# Altium project PCB_PROJECT1.PRJPCB
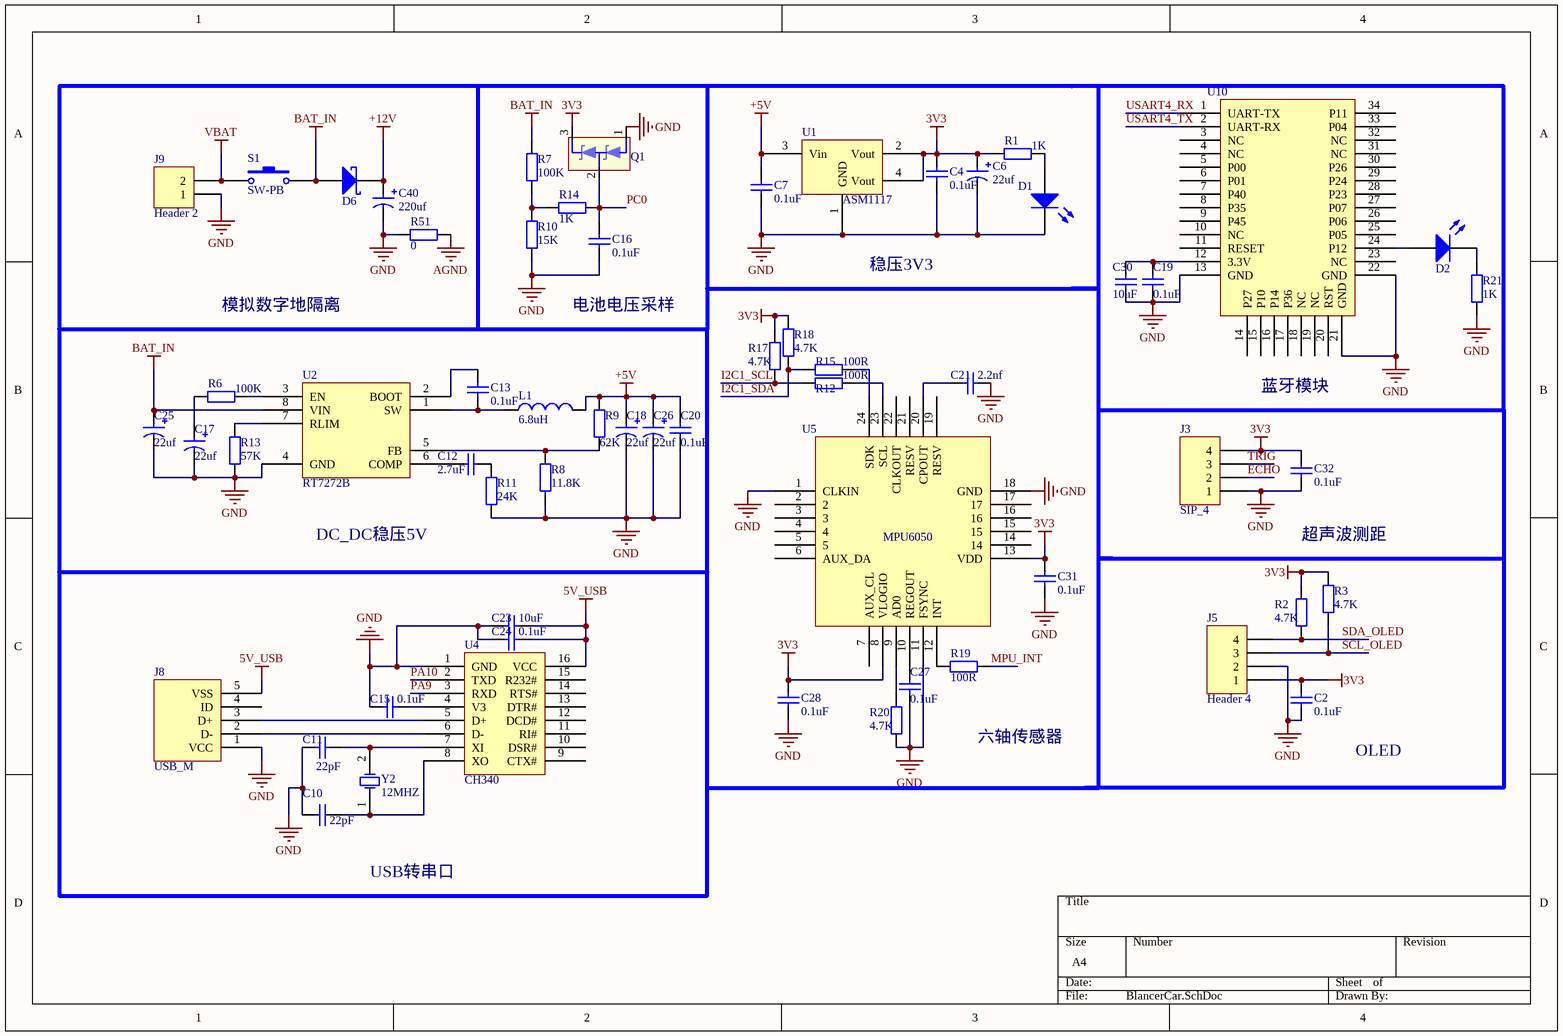
[diagram p0: BlancerCar.SchDoc]
3 sheets, 138 parts. Net scope: global (net labels, ports and power ports of the same name join across sheets).
Board file: BlanceCar.PcbDoc
Sheets:
  BlancerCar.SchDoc
  BlancerCarMicrocontrollers.SchDoc
  BlancerCarMotoDriver.SchDoc

## Sheet BlancerCar.SchDoc
size A4

### Parts
C2  value 0.1uF  [0805-1]  (hidden comment: Cap)
C4  value 0.1uF  [0805-1]  (hidden comment: Cap)
C6  value 22uf  [钽电容XDH]  (hidden comment: Cap钽电容)
C7  value 0.1uF  [0805-1]  (hidden comment: Cap)
C10  value 22pF  [0805-1]  (hidden comment: Cap)
C11  value 22pF  [0805-1]  (hidden comment: Cap)
C12  value 2.7uF  [0805-1]  (hidden comment: Cap)
C13  value 0.1uF  [0805-1]  (hidden comment: Cap)
C15  value 0.1uF  [0805-1]  (hidden comment: Cap)
C16  value 0.1uF  [0805-1]  (hidden comment: Cap)
C17  value 22uf  [钽电容XDH]  (hidden comment: Cap钽电容)
C18  value 22uf  [钽电容XDH]  (hidden comment: Cap钽电容)
C19  value 0.1uF  [0805-1]  (hidden comment: Cap)
C20  value 0.1uF  [0805-1]  (hidden comment: Cap)
C21  value 2.2nf  [0805-1]  (hidden comment: Cap)
C23  value 10uF  [0805-1]  (hidden comment: Cap)
C24  value 0.1uF  [0805-1]  (hidden comment: Cap)
C25  value 22uf  [钽电容XDH]  (hidden comment: Cap钽电容)
C26  value 22uf  [钽电容XDH]  (hidden comment: Cap钽电容)
C27  value 0.1uF  [0805-1]  (hidden comment: Cap)
C28  value 0.1uF  [0805-1]  (hidden comment: Cap)
C30  value 10uF  [0805-1]  (hidden comment: Cap)
C31  value 0.1uF  [0805-1]  (hidden comment: Cap)
C32  value 0.1uF  [0805-1]  (hidden comment: Cap)
C40  value 220uf  [电容220UF]  (hidden comment: Cap钽电容)
D1  LED0  [LED_0805]  (value not drawn)
D2  LED0  [LED_0805]  (value not drawn)
D6  肖基特二极管  [SS54]  (value not drawn)
J3  SIP_4  [HDR1X4]
J5  Header 4  [HDR1X4]
J8  USB_M  [USB_MICRO]
J9  Header 2  [T字公头]
L1  value 6.8uH  [33uh电感]  (hidden comment: Inductor)
Q1  肖基特二极管  [BAT54S(SOT-23-3)]  (value not drawn)
R1  value 1K  [0805-1]  (hidden comment: Res1)
R2  value 4.7K  [0805-1]  (hidden comment: Res1)
R3  value 4.7K  [0805-1]  (hidden comment: Res1)
R6  value 100K  [0805-1]  (hidden comment: Res1)
R7  value 100K  [0805-1]  (hidden comment: Res1)
R8  value 11.8K  [0805-1]  (hidden comment: Res1)
R9  value 62K  [0805-1]  (hidden comment: Res1)
R10  value 15K  [0805-1]  (hidden comment: Res1)
R11  value 24K  [0805-1]  (hidden comment: Res1)
R12  value 100R  [0805-1]  (hidden comment: Res1)
R13  value 57K  [0805-1]  (hidden comment: Res1)
R14  value 1K  [0805-1]  (hidden comment: Res1)
R15  value 100R  [0805-1]  (hidden comment: Res1)
R17  value 4.7K  [0805-1]  (hidden comment: Res1)
R18  value 4.7K  [0805-1]  (hidden comment: Res1)
R19  value 100R  [0805-1]  (hidden comment: Res1)
R20  value 4.7K  [0805-1]  (hidden comment: Res1)
R21  value 1K  [0805-1]  (hidden comment: Res1)
R51  value 0  [0805-1]  (hidden comment: Res1)
S1  SW-PB  [开关 6A]
U1  ASM1117  [ASM1117]
U2  RT7272B  [SOIC_8(LC)]
U4  CH340  [SOP16]
U5  MPU6050  [MPU6050]
U10  蓝牙模块  [LANYA]  (value not drawn)
Y2  12MHZ  [晶振 8M]

### Nets
3V3: C2.2 C4.2 C6.1 C28.2 C31.2 C32.2 J3.4 J5.1 Q1.3 R1.1 R2.2 R3.2 R17.2 R18.2 U1.2(Vout) U1.4(Vout) U5.8(VLOGIO) U5.13(VDD)
5V_USB: C23.2 C24.2 J8.5(VSS) U4.16(VCC)
+5V: C7.2 C18.1 C20.1 C26.1 L1.2 R9.2 U1.3(Vin)
+12V: C40.1 D6.2(K)
AGND: R51.2
BAT_IN: C25.1 D6.1(A) R7.2 S1.2 U2.8(VIN)
GND: C2.1 C4.1 C6.2 C7.1 C10.2 C11.2 C15.1 C16.1 C17.2 C18.2 C19.1 C20.2 C21.2 C23.1 C24.1 C25.2 C26.2 C27.1 C28.1 C30.1 C31.1 C32.1 C40.2 D1.2(K) J3.1 J5.2 J8.1(VCC) J9.1 Q1.1 R8.1 R10.1 R11.1 R13.1 R20.1 R21.1 R51.1 U1.1(GND) U2.4(GND) U4.1(GND) U5.1(CLKIN) U5.11(FSYNC) U5.18(GND) U10.13(GND) U10.21(GND) U10.22(GND)
VBAT: J9.2 S1.1
ECHO: J3.2
I2C1_SCL: R12.2 R17.1
I2C1_SDA: R15.2 R18.1
MPU_INT: R19.1
PA9: U4.3(RXD)
PA10: U4.2(TXD)
PC0: C16.2 Q1.2 R14.1
SCL_OLED: J5.3 R3.1
SDA_OLED: J5.4 R2.1
TRIG: J3.3
USART4_RX: U10.1(UART-TX)
USART4_TX: U10.2(UART-RX)
NetC10_1: C10.1 U4.8(XO) Y2.1(OSC1)
NetC11_1: C11.1 U4.7(XI) Y2.2(OSC2)
NetC12_1: C12.1 U2.6(COMP)
NetC12_2: C12.2 R11.2
NetC13_1: C13.1 L1.1 U2.1(SW)
NetC13_2: C13.2 U2.2(BOOT)
NetC15_2: C15.2 U4.4(V3)
NetC17_1: C17.1 R6.1
NetC19_2: C19.2 C30.2 U10.12(3.3V)
NetC21_1: C21.1 U5.20(CPOUT)
NetC27_2: C27.2 U5.10(REGOUT)
NetD1_1: D1.1(A) R1.2
NetD2_1: D2.1(A) U10.24(P12)
NetD2_2: D2.2(K) R21.2
NetJ8_2: J8.2(D-) U4.6(D-)
NetJ8_3: J8.3(D+) U4.5(D+)
NetR6_2: R6.2 U2.3(EN)
NetR7_1: R7.1 R10.2 R14.2
NetR8_2: R8.2 R9.1 U2.5(FB)
NetR12_1: R12.1 U5.23(SCL)
NetR13_2: R13.2 U2.7(RLIM)
NetR15_1: R15.1 U5.24(SDK)
NetR19_2: R19.2 U5.12(INT)
NetR20_2: R20.2 U5.9(AD0)

Not connected (* = marked no-connect by the designer): J8 4(ID); U4 9(CTX#) 10(DSR#) 11(RI#) 12(DCD#) 13(DTR#) 14(RTS#) 15(R232#); U5 2 3 4 5 6(AUX_DA) 7(AUX_CL) 14 15 16 17 19(RESV) 21(RESV) 22(CLKOUT); U10 3(NC) 4(NC) 5(P00) 6(P01) 7(P40) 8(P35) 9(P45) 10(NC) 11(RESET) 14(P27) 15(P10) 16(P14) 17(P36) 18(NC) 19(NC) 20(RST) 23(NC) 25(P05) 26(P06) 27(P07) 28(P23) 29(P24) 30(P26) 31(NC) 32(NC) 33(P04) 34(P11)

### Notes on the sheet
- 模拟数字地隔离
- 电池电压采样
- 稳压3V3
- 蓝牙模块
- DC_DC稳压5V
- 超声波测距
- 六轴传感器
- OLED
- USB转串口

### Library data of the parts
C2 C4 C7 C10-C13 C15 C16 C19-C21 C23 C24 C27 C28 C30-C32 = Cap: Capacitor; Published: 8-Jun-2000; LatestRevisionDate: 17-Jul-2002; LatestRevisionNote: Re-released for DXP Platform.; PackageReference: RAD-0.3; Publisher: Altium Limited
C6 C17 C18 C25 C26 C40 = Cap-dan
D1 D2 = LED0: 发光二极管; Published: 8-Jun-2000; LatestRevisionDate: 08-Jul-2005; LatestRevisionNote: Mech Layer 1 removed.; PackageReference: LED-0; Publisher: Altium Limited
D6 = SS54
J3 J5 = Header 4: Header, 4-Pin; LatestRevisionDate: 17-Jul-2002; LatestRevisionNote: Re-released for DXP Platform.; Publisher: Altium Limited
J8 = USB_M: MicroUSB接口
J9 = Header 2: Header, 2-Pin; LatestRevisionDate: 17-Jul-2002; LatestRevisionNote: Re-released for DXP Platform.; Publisher: Altium Limited
L1 = Inductor: Code_IEC: 1005; Published: 8-Jun-2000; LatestRevisionDate: 29-May-2009; LatestRevisionNote: IPC-7351 Footprint Added.; PackageReference: 0402-A; Publisher: Altium Limited; PackageDescription: Chip Inductor; Code_JEITA: 0402
Q1 = BAT54S
R1-R3 R6-R15 R17-R21 R51 = Res1: 贴片电阻; Published: 8-Jun-2000; LatestRevisionDate: 17-Jul-2002; LatestRevisionNote: Re-released for DXP Platform.; PackageReference: AXIAL-0.4; Publisher: Altium Limited
S1 = SW-PB: Switch; Published: 24-Mar-1999; LatestRevisionDate: 17-Jul-2002; LatestRevisionNote: Re-released for DXP Platform.; PackageReference: SPST-2; Publisher: Altium Limited; PackageDescription: Switch; 2 Leads
U2 = RT7272B: RT7272B同步降压型DC-DC转换器
U5 = MPU6050_
U10 = 蓝牙
Y2 = XTAL: Crystal Oscillator; Published: 8-Jun-2000; LatestRevisionDate: 17-Jul-2002; LatestRevisionNote: Re-released for DXP Platform.; PackageReference: R38; Publisher: Altium Limited; PackageDescription: Crystal, Thru-Hole; 2 Leads; Body 3.1 x 8.2 mm (Dia.xH)

## Sheet BlancerCarMicrocontrollers.SchDoc
size A4
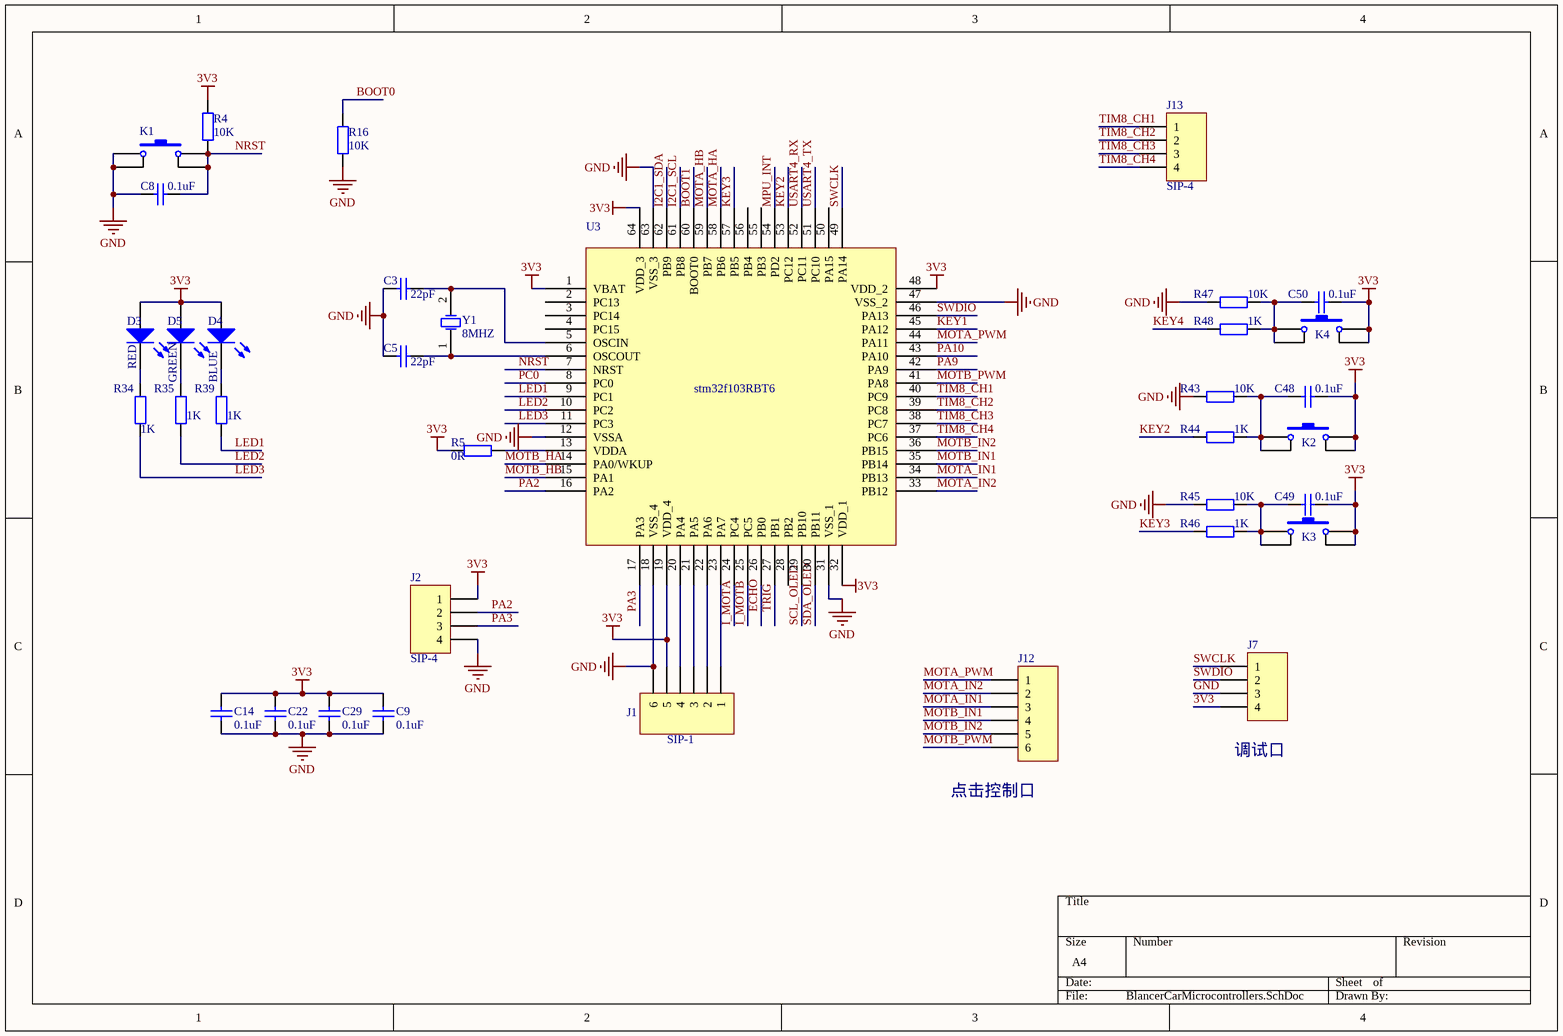
[diagram p1: BlancerCarMicrocontrollers.SchDoc]

### Parts
C3  value 22pF  [0805-1]  (hidden comment: Cap)
C5  value 22pF  [0805-1]  (hidden comment: Cap)
C8  value 0.1uF  [0805-1]  (hidden comment: Cap)
C9  value 0.1uF  [0805-1]  (hidden comment: Cap)
C14  value 0.1uF  [0805-1]  (hidden comment: Cap)
C22  value 0.1uF  [0805-1]  (hidden comment: Cap)
C29  value 0.1uF  [0805-1]  (hidden comment: Cap)
C48  value 0.1uF  [0805-1]  (hidden comment: Cap)
C49  value 0.1uF  [0805-1]  (hidden comment: Cap)
C50  value 0.1uF  [0805-1]  (hidden comment: Cap)
D3  RED  [LED_0805]
D4  BLUE  [LED_0805]
D5  GREEN  [LED_0805]
J1  SIP-1  [HDR1X6]
J2  SIP-4  [HDR1X4]
J7  Header 4  [HDR1X4]  (value not drawn)
J12  Header 6  [HDR1X6]  (value not drawn)
J13  SIP-4  [HDR1X4]
K1  SW-PB4  [SW_PB4_A1]  (value not drawn)
K2  SW-PB4  [SW_PB4_A1]  (value not drawn)
K3  SW-PB4  [SW_PB4_A1]  (value not drawn)
K4  SW-PB4  [SW_PB4_A1]  (value not drawn)
R4  value 10K  [0805-1]  (hidden comment: Res1)
R5  value 0R  [0805-1]  (hidden comment: Res1)
R16  value 10K  [0805-1]  (hidden comment: Res1)
R34  value 1K  [0805-1]  (hidden comment: Res1)
R35  value 1K  [0805-1]  (hidden comment: Res1)
R39  value 1K  [0805-1]  (hidden comment: Res1)
R43  value 10K  [0805-1]  (hidden comment: Res1)
R44  value 1K  [0805-1]  (hidden comment: Res1)
R45  value 10K  [0805-1]  (hidden comment: Res1)
R46  value 1K  [0805-1]  (hidden comment: Res1)
R47  value 10K  [0805-1]  (hidden comment: Res1)
R48  value 1K  [0805-1]  (hidden comment: Res1)
U3  stm32f103RBT6  [STM32F103RBT6(LQFP-64)]
Y1  8MHZ  [晶振 8M]

### Nets
3V3: C9.2 C14.2 C22.2 C29.2 C48.2 C49.2 C50.2 D3.1(A) D4.1(A) D5.1(A) J1.5 J2.1 J7.4 K2.2 K2.3 K3.2 K3.3 K4.2 K4.3 R4.1 R5.1 U3.1(VBAT) U3.19(VDD_4) U3.32(VDD_1) U3.48(VDD_2) U3.64(VDD_3)
GND: C3.1 C5.1 C8.1 C9.1 C14.1 C22.1 C29.1 J1.6 J2.4 J7.3 K1.1 K1.4 R16.1 R43.1 R45.1 R47.1 U3.12(VSSA) U3.18(VSS_4) U3.31(VSS_1) U3.47(VSS_2) U3.63(VSS_3)
BOOT0: R16.2
BOOT1: U3.60(BOOT0)
ECHO: U3.26(PB0)
I2C1_SCL: U3.61(PB8)
I2C1_SDA: U3.62(PB9)
I_MOTA: U3.24(PC4)
I_MOTB: U3.25(PC5)
KEY1: U3.45(PA12)
KEY2: R44.1 U3.53(PC12)
KEY3: R46.1 U3.57(PB5)
KEY4: R48.1
LED1: R39.1 U3.9(PC1)
LED2: R35.1 U3.10(PC2)
LED3: R34.1 U3.11(PC3)
MOTA_HA: U3.58(PB6)
MOTA_HB: U3.59(PB7)
MOTA_IN1: J12.3 U3.34(PB13)
MOTA_IN2: J12.2 U3.33(PB12)
MOTA_PWM: J12.1 U3.44(PA11)
MOTB_HA: U3.14(PA0/WKUP)
MOTB_HB: U3.15(PA1)
MOTB_IN1: J12.4 U3.35(PB14)
MOTB_IN2: J12.5 U3.36(PB15)
MOTB_PWM: J12.6 U3.41(PA8)
MPU_INT: U3.54(PD2)
NRST: C8.2 K1.2 K1.3 R4.2 U3.7(NRST)
PA2: J2.2 U3.16(PA2)
PA3: J2.3 U3.17(PA3)
PA9: U3.42(PA9)
PA10: U3.43(PA10)
PC0: U3.8(PC0)
SCL_OLED: U3.29(PB10)
SDA_OLED: U3.30(PB11)
SWCLK: J7.1 U3.49(PA14)
SWDIO: J7.2 U3.46(PA13)
TIM8_CH1: J13.1 U3.40(PC9)
TIM8_CH2: J13.2 U3.39(PC8)
TIM8_CH3: J13.3 U3.38(PC7)
TIM8_CH4: J13.4 U3.37(PC6)
TRIG: U3.27(PB1)
USART4_RX: U3.52(PC11)
USART4_TX: U3.51(PC10)
NetC3_2: C3.2 U3.5(OSCIN) Y1.2(OSC2)
NetC5_2: C5.2 U3.6(OSCOUT) Y1.1(OSC1)
NetC48_1: C48.1 K2.1 K2.4 R43.2 R44.2
NetC49_1: C49.1 K3.1 K3.4 R45.2 R46.2
NetC50_1: C50.1 K4.1 K4.4 R47.2 R48.2
NetD3_2: D3.2(K) R34.2
NetD4_2: D4.2(K) R39.2
NetD5_2: D5.2(K) R35.2
NetJ1_1: J1.1 U3.23(PA7)
NetJ1_2: J1.2 U3.22(PA6)
NetJ1_3: J1.3 U3.21(PA5)
NetJ1_4: J1.4 U3.20(PA4)
NetR5_2: R5.2 U3.13(VDDA)

Not connected (* = marked no-connect by the designer): U3 2(PC13) 3(PC14) 4(PC15) 28(PB2) 50(PA15) 55(PB3) 56(PB4)

### Notes on the sheet
- (near J7) 调试口
- (near J12) 点击控制口

### Library data of the parts
C3 C5 C8 C9 C14 C22 C29 C48-C50 = Cap: Capacitor; Published: 8-Jun-2000; LatestRevisionDate: 17-Jul-2002; LatestRevisionNote: Re-released for DXP Platform.; PackageReference: RAD-0.3; Publisher: Altium Limited
D3-D5 = LED0: 发光二极管; Published: 8-Jun-2000; LatestRevisionDate: 08-Jul-2005; LatestRevisionNote: Mech Layer 1 removed.; PackageReference: LED-0; Publisher: Altium Limited
J1 J12 = Header 6: Header, 6-Pin; LatestRevisionDate: 17-Jul-2002; LatestRevisionNote: Re-released for DXP Platform.; Publisher: Altium Limited
J2 J7 J13 = Header 4: Header, 4-Pin; LatestRevisionDate: 17-Jul-2002; LatestRevisionNote: Re-released for DXP Platform.; Publisher: Altium Limited
K1-K4 = SW-PB4: 微动开关; Published: 24-Mar-1999; LatestRevisionDate: 17-Jul-2002; LatestRevisionNote: Re-released for DXP Platform.; PackageReference: SPST-2; Publisher: Altium Limited
R4 R5 R16 R34 R35 R39 R43-R48 = Res1: 贴片电阻; Published: 8-Jun-2000; LatestRevisionDate: 17-Jul-2002; LatestRevisionNote: Re-released for DXP Platform.; PackageReference: AXIAL-0.4; Publisher: Altium Limited
Y1 = XTAL: Crystal Oscillator; Published: 8-Jun-2000; LatestRevisionDate: 17-Jul-2002; LatestRevisionNote: Re-released for DXP Platform.; PackageReference: R38; Publisher: Altium Limited; PackageDescription: Crystal, Thru-Hole; 2 Leads; Body 3.1 x 8.2 mm (Dia.xH)

## Sheet BlancerCarMotoDriver.SchDoc
size A4
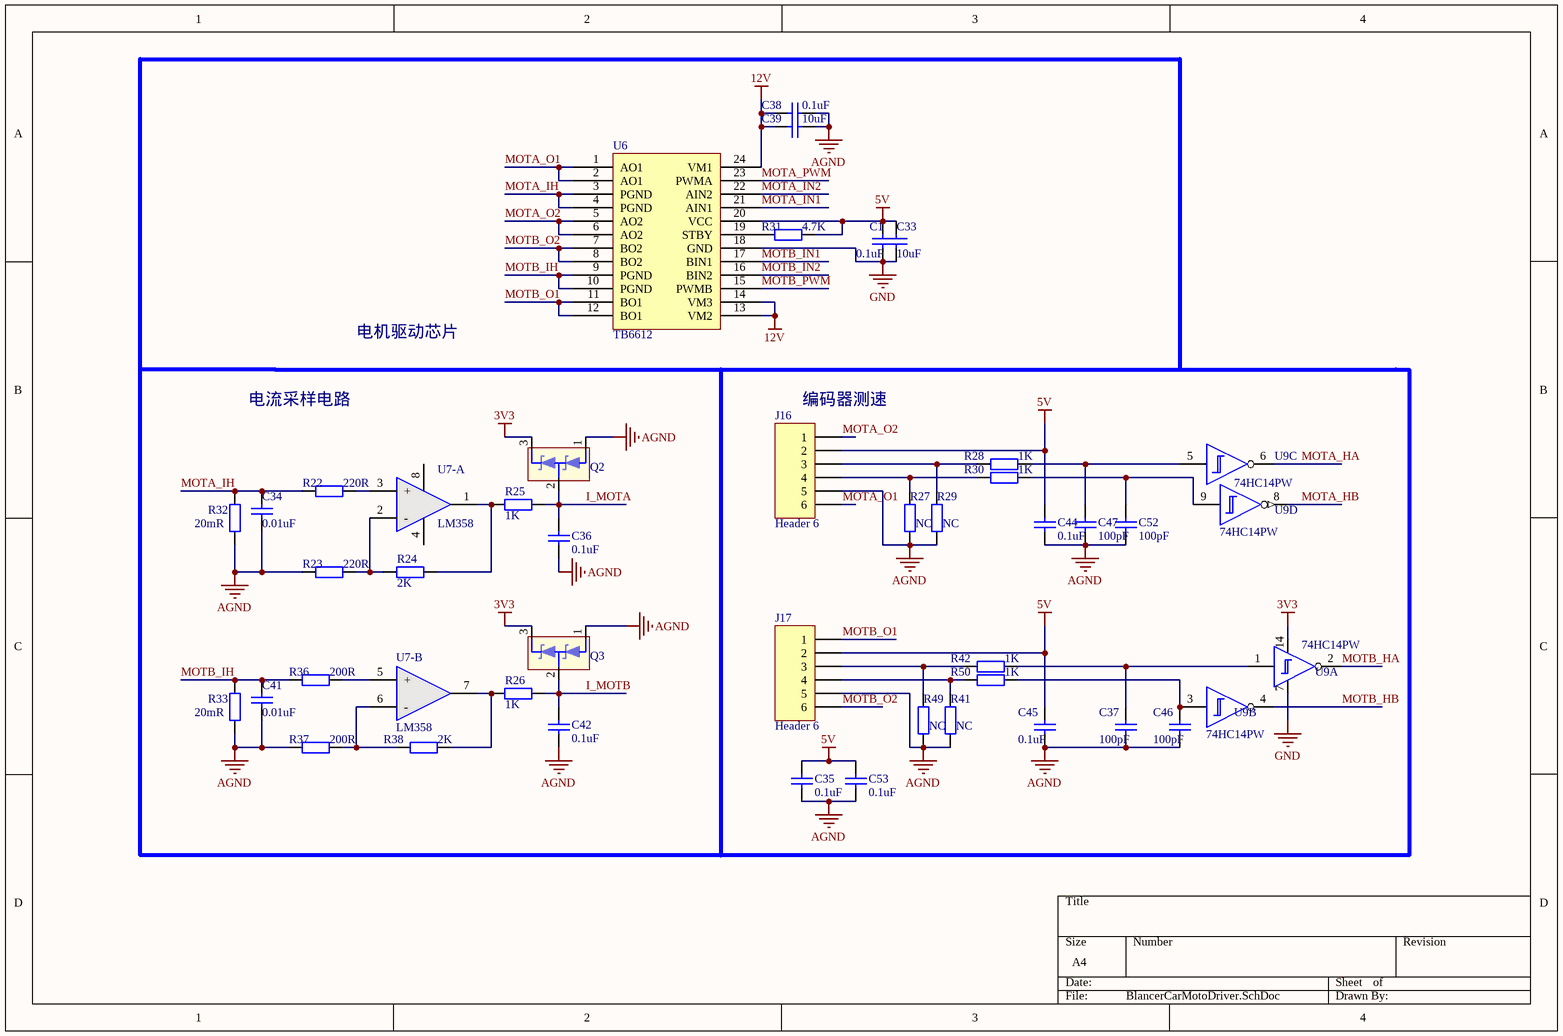
[diagram p2: BlancerCarMotoDriver.SchDoc]

### Parts
C1  value 0.1uF  [0805-1]  (hidden comment: Cap)
C33  value 10uF  [0805-1]  (hidden comment: Cap)
C34  value 0.01uF  [0805-1]  (hidden comment: Cap)
C35  value 0.1uF  [0805-1]  (hidden comment: Cap)
C36  value 0.1uF  [0805-1]  (hidden comment: Cap)
C37  value 100pF  [0805-1]  (hidden comment: Cap)
C38  value 0.1uF  [0805-1]  (hidden comment: Cap)
C39  value 10uF  [0805-1]  (hidden comment: Cap)
C41  value 0.01uF  [0805-1]  (hidden comment: Cap)
C42  value 0.1uF  [0805-1]  (hidden comment: Cap)
C44  value 0.1uF  [0805-1]  (hidden comment: Cap)
C45  value 0.1uF  [0805-1]  (hidden comment: Cap)
C46  value 100pF  [0805-1]  (hidden comment: Cap)
C47  value 100pF  [0805-1]  (hidden comment: Cap)
C52  value 100pF  [0805-1]  (hidden comment: Cap)
C53  value 0.1uF  [0805-1]  (hidden comment: Cap)
J16  Header 6  [HDR1X6]
J17  Header 6  [HDR1X6]
Q2  肖基特二极管  [BAT54S(SOT-23-3)]  (value not drawn)
Q3  肖基特二极管  [BAT54S(SOT-23-3)]  (value not drawn)
R22  value 220R  [0805-1]  (hidden comment: Res1)
R23  value 220R  [0805-1]  (hidden comment: Res1)
R24  value 2K  [0805-1]  (hidden comment: Res1)
R25  value 1K  [0805-1]  (hidden comment: Res1)
R26  value 1K  [0805-1]  (hidden comment: Res1)
R27  value NC  [0805-1]  (hidden comment: Res1)
R28  value 1K  [0805-1]  (hidden comment: Res1)
R29  value NC  [0805-1]  (hidden comment: Res1)
R30  value 1K  [0805-1]  (hidden comment: Res1)
R31  value 4.7K  [0805-1]  (hidden comment: Res1)
R32  value 20mR  [0805-1]  (hidden comment: Res1)
R33  value 20mR  [0805-1]  (hidden comment: Res1)
R36  value 200R  [0805-1]  (hidden comment: Res1)
R37  value 200R  [0805-1]  (hidden comment: Res1)
R38  value 2K  [0805-1]  (hidden comment: Res1)
R41  value NC  [0805-1]  (hidden comment: Res1)
R42  value 1K  [0805-1]  (hidden comment: Res1)
R49  value NC  [0805-1]  (hidden comment: Res1)
R50  value 1K  [0805-1]  (hidden comment: Res1)
U6  TB6612  [TB6612]
U7-  LM358  [NSO8_N]  (parts A,B of 2)
U9  74HC14PW  [SSOP-14]  (parts A,B,C,D of 6)

### Nets
3V3: Q2.3 Q3.3 U9.14(VCC)
5V: C1.2 C33.2 C35.2 C44.2 C45.2 C53.2 J16.2 J17.2 R31.2 U6.20(VCC)
12V: C38.1 C39.1 U6.13(VM2) U6.14(VM3) U6.24(VM1)
AGND: C34.1 C35.1 C36.1 C37.1 C38.2 C39.2 C41.1 C42.1 C44.1 C45.1 C46.1 C47.1 C52.1 C53.1 J16.5 J17.5 Q2.1 Q3.1 R23.1 R27.1 R29.1 R32.1 R33.1 R37.2 R41.1 R49.1
GND: C1.1 C33.1 U6.18(GND) U9.7
I_MOTA: C36.2 Q2.2 R25.2
I_MOTB: C42.2 Q3.2 R26.1
MOTA_HA: U9.6(Y)
MOTA_HB: U9.8(Y)
MOTA_IH: C34.2 R22.1 R32.2 U6.3(PGND) U6.4(PGND)
MOTA_IN1: U6.21(AIN1)
MOTA_IN2: U6.22(AIN2)
MOTA_O1: J16.6 U6.1(AO1) U6.2(AO1)
MOTA_O2: J16.1 U6.5(AO2) U6.6(AO2)
MOTA_PWM: U6.23(PWMA)
MOTB_HA: U9.2(Y)
MOTB_HB: U9.4(Y)
MOTB_IH: C41.2 R33.2 R36.2 U6.9(PGND) U6.10(PGND)
MOTB_IN1: U6.17(BIN1)
MOTB_IN2: U6.16(BIN2)
MOTB_O1: J17.1 U6.11(BO1) U6.12(BO1)
MOTB_O2: J17.6 U6.7(BO2) U6.8(BO2)
MOTB_PWM: U6.15(PWMB)
NetC37_2: C37.2 R42.2 U9.1(A)
NetC46_2: C46.2 R50.2 U9.3(A)
NetC47_2: C47.2 R28.2 U9.5(A)
NetC52_2: C52.2 R30.2 U9.9(A)
NetJ16_3: J16.3 R28.1 R29.2
NetJ16_4: J16.4 R27.2 R30.1
NetJ17_3: J17.3 R42.1 R49.2
NetJ17_4: J17.4 R41.2 R50.1
NetR22_2: R22.2 U7-.3(+)
NetR23_2: R23.2 R24.1 U7-.2(-)
NetR24_2: R24.2 R25.1 U7-.1(OUT1)
NetR26_2: R26.2 R38.1 U7-.7(OUT2)
NetR31_1: R31.1 U6.19(STBY)
NetR36_1: R36.1 U7-.5(+)
NetR37_1: R37.1 R38.2 U7-.6(-)

Not connected (* = marked no-connect by the designer): U7- 4(V-) 8(V+)

### Notes on the sheet
- 电机驱动芯片
- 电流采样电路
- (near J16) 编码器测速

### Library data of the parts
C1 C33-C39 C41 C42 C44-C47 C52 C53 = Cap: Capacitor; Published: 8-Jun-2000; LatestRevisionDate: 17-Jul-2002; LatestRevisionNote: Re-released for DXP Platform.; PackageReference: RAD-0.3; Publisher: Altium Limited
J16 J17 = Header 6: Header, 6-Pin; LatestRevisionDate: 17-Jul-2002; LatestRevisionNote: Re-released for DXP Platform.; Publisher: Altium Limited
Q2 Q3 = BAT54S
R22-R33 R36-R38 R41 R42 R49 R50 = Res1: 贴片电阻; Published: 8-Jun-2000; LatestRevisionDate: 17-Jul-2002; LatestRevisionNote: Re-released for DXP Platform.; PackageReference: AXIAL-0.4; Publisher: Altium Limited
U7- = LM358: 双运放
U9 = 74HC14PW: 6非门

## Nets that join several sheets
3V3: BlancerCar (18 pins), BlancerCarMicrocontrollers (26 pins), BlancerCarMotoDriver (Q2.3 Q3.3 U9.14)
AGND: BlancerCar (R51.2), BlancerCarMotoDriver (26 pins)
GND: BlancerCar (45 pins), BlancerCarMicrocontrollers (21 pins), BlancerCarMotoDriver (C1.1 C33.1 U6.18 U9.7)
ECHO: BlancerCar (J3.2), BlancerCarMicrocontrollers (U3.26)
I2C1_SCL: BlancerCar (R12.2 R17.1), BlancerCarMicrocontrollers (U3.61)
I2C1_SDA: BlancerCar (R15.2 R18.1), BlancerCarMicrocontrollers (U3.62)
I_MOTA: BlancerCarMicrocontrollers (U3.24), BlancerCarMotoDriver (C36.2 Q2.2 R25.2)
I_MOTB: BlancerCarMicrocontrollers (U3.25), BlancerCarMotoDriver (C42.2 Q3.2 R26.1)
MOTA_HA: BlancerCarMicrocontrollers (U3.58), BlancerCarMotoDriver (U9.6)
MOTA_HB: BlancerCarMicrocontrollers (U3.59), BlancerCarMotoDriver (U9.8)
MOTA_IN1: BlancerCarMicrocontrollers (J12.3 U3.34), BlancerCarMotoDriver (U6.21)
MOTA_IN2: BlancerCarMicrocontrollers (J12.2 U3.33), BlancerCarMotoDriver (U6.22)
MOTA_PWM: BlancerCarMicrocontrollers (J12.1 U3.44), BlancerCarMotoDriver (U6.23)
MOTB_HA: BlancerCarMicrocontrollers (U3.14), BlancerCarMotoDriver (U9.2)
MOTB_HB: BlancerCarMicrocontrollers (U3.15), BlancerCarMotoDriver (U9.4)
MOTB_IN1: BlancerCarMicrocontrollers (J12.4 U3.35), BlancerCarMotoDriver (U6.17)
MOTB_IN2: BlancerCarMicrocontrollers (J12.5 U3.36), BlancerCarMotoDriver (U6.16)
MOTB_PWM: BlancerCarMicrocontrollers (J12.6 U3.41), BlancerCarMotoDriver (U6.15)
MPU_INT: BlancerCar (R19.1), BlancerCarMicrocontrollers (U3.54)
PA9: BlancerCar (U4.3), BlancerCarMicrocontrollers (U3.42)
PA10: BlancerCar (U4.2), BlancerCarMicrocontrollers (U3.43)
PC0: BlancerCar (C16.2 Q1.2 R14.1), BlancerCarMicrocontrollers (U3.8)
SCL_OLED: BlancerCar (J5.3 R3.1), BlancerCarMicrocontrollers (U3.29)
SDA_OLED: BlancerCar (J5.4 R2.1), BlancerCarMicrocontrollers (U3.30)
TRIG: BlancerCar (J3.3), BlancerCarMicrocontrollers (U3.27)
USART4_RX: BlancerCar (U10.1), BlancerCarMicrocontrollers (U3.52)
USART4_TX: BlancerCar (U10.2), BlancerCarMicrocontrollers (U3.51)